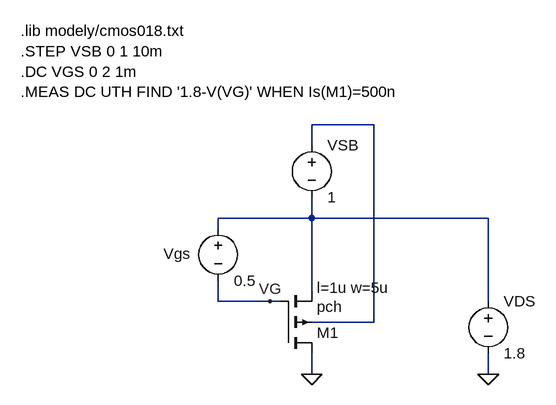
[diagram p0: schematic P3-mos.asc]
P3-mos.asc, the LTspice schematic file:
Version 4
SHEET 1 1628 680
WIRE 320 -80 224 -80
WIRE 224 -48 224 -80
WIRE 224 64 224 32
WIRE 224 64 80 64
WIRE 496 64 224 64
WIRE 80 80 80 64
WIRE 224 176 224 64
WIRE 80 192 80 160
WIRE 160 192 80 192
WIRE 176 192 160 192
WIRE 496 192 496 64
WIRE 320 224 320 -80
WIRE 320 224 224 224
WIRE 224 304 224 272
WIRE 496 304 496 272
FLAG 224 304 0
FLAG 496 304 0
FLAG 160 192 VG
SYMBOL voltage 80 64 R0
WINDOW 123 0 0 Left 0
WINDOW 39 0 0 Left 0
WINDOW 0 -43 55 Right 2
SYMATTR InstName Vgs
SYMATTR Value 0.5
SYMBOL voltage 496 176 R0
WINDOW 123 0 0 Left 0
WINDOW 39 0 0 Left 0
SYMATTR InstName VDS
SYMATTR Value 1.8
SYMBOL pmos4 176 272 M180
WINDOW 123 56 101 Left 2
SYMATTR Value2 l=1u w=5u
SYMATTR InstName M1
SYMATTR Value pch
SYMBOL voltage 224 -64 R0
WINDOW 123 0 0 Left 0
WINDOW 39 0 0 Left 0
SYMATTR InstName VSB
SYMATTR Value 1
TEXT -224 -224 Left 2 !.lib modely/cmos018.txt\n.STEP VSB 0 1 10m\n.DC VGS 0 2 1m\n.MEAS DC UTH FIND '1.8-V(VG)' WHEN Is(M1)=500n

The netlist it stands for:
* P3-mos.asc
Vgs N002 VG 0.5
VDS N002 0 1.8
M1 0 VG N002 N001 pch l=1u w=5u
VSB N001 N002 1
.model NMOS NMOS
.model PMOS PMOS
.lib standard.mos
.lib modely/cmos018.txt
.STEP VSB 0 1 10m
.DC VGS 0 2 1m
.MEAS DC UTH FIND '1.8-V(VG)' WHEN Is(M1)=500n
.backanno
.end